# EAGLE schematic Sen (EAGLE 6.0)
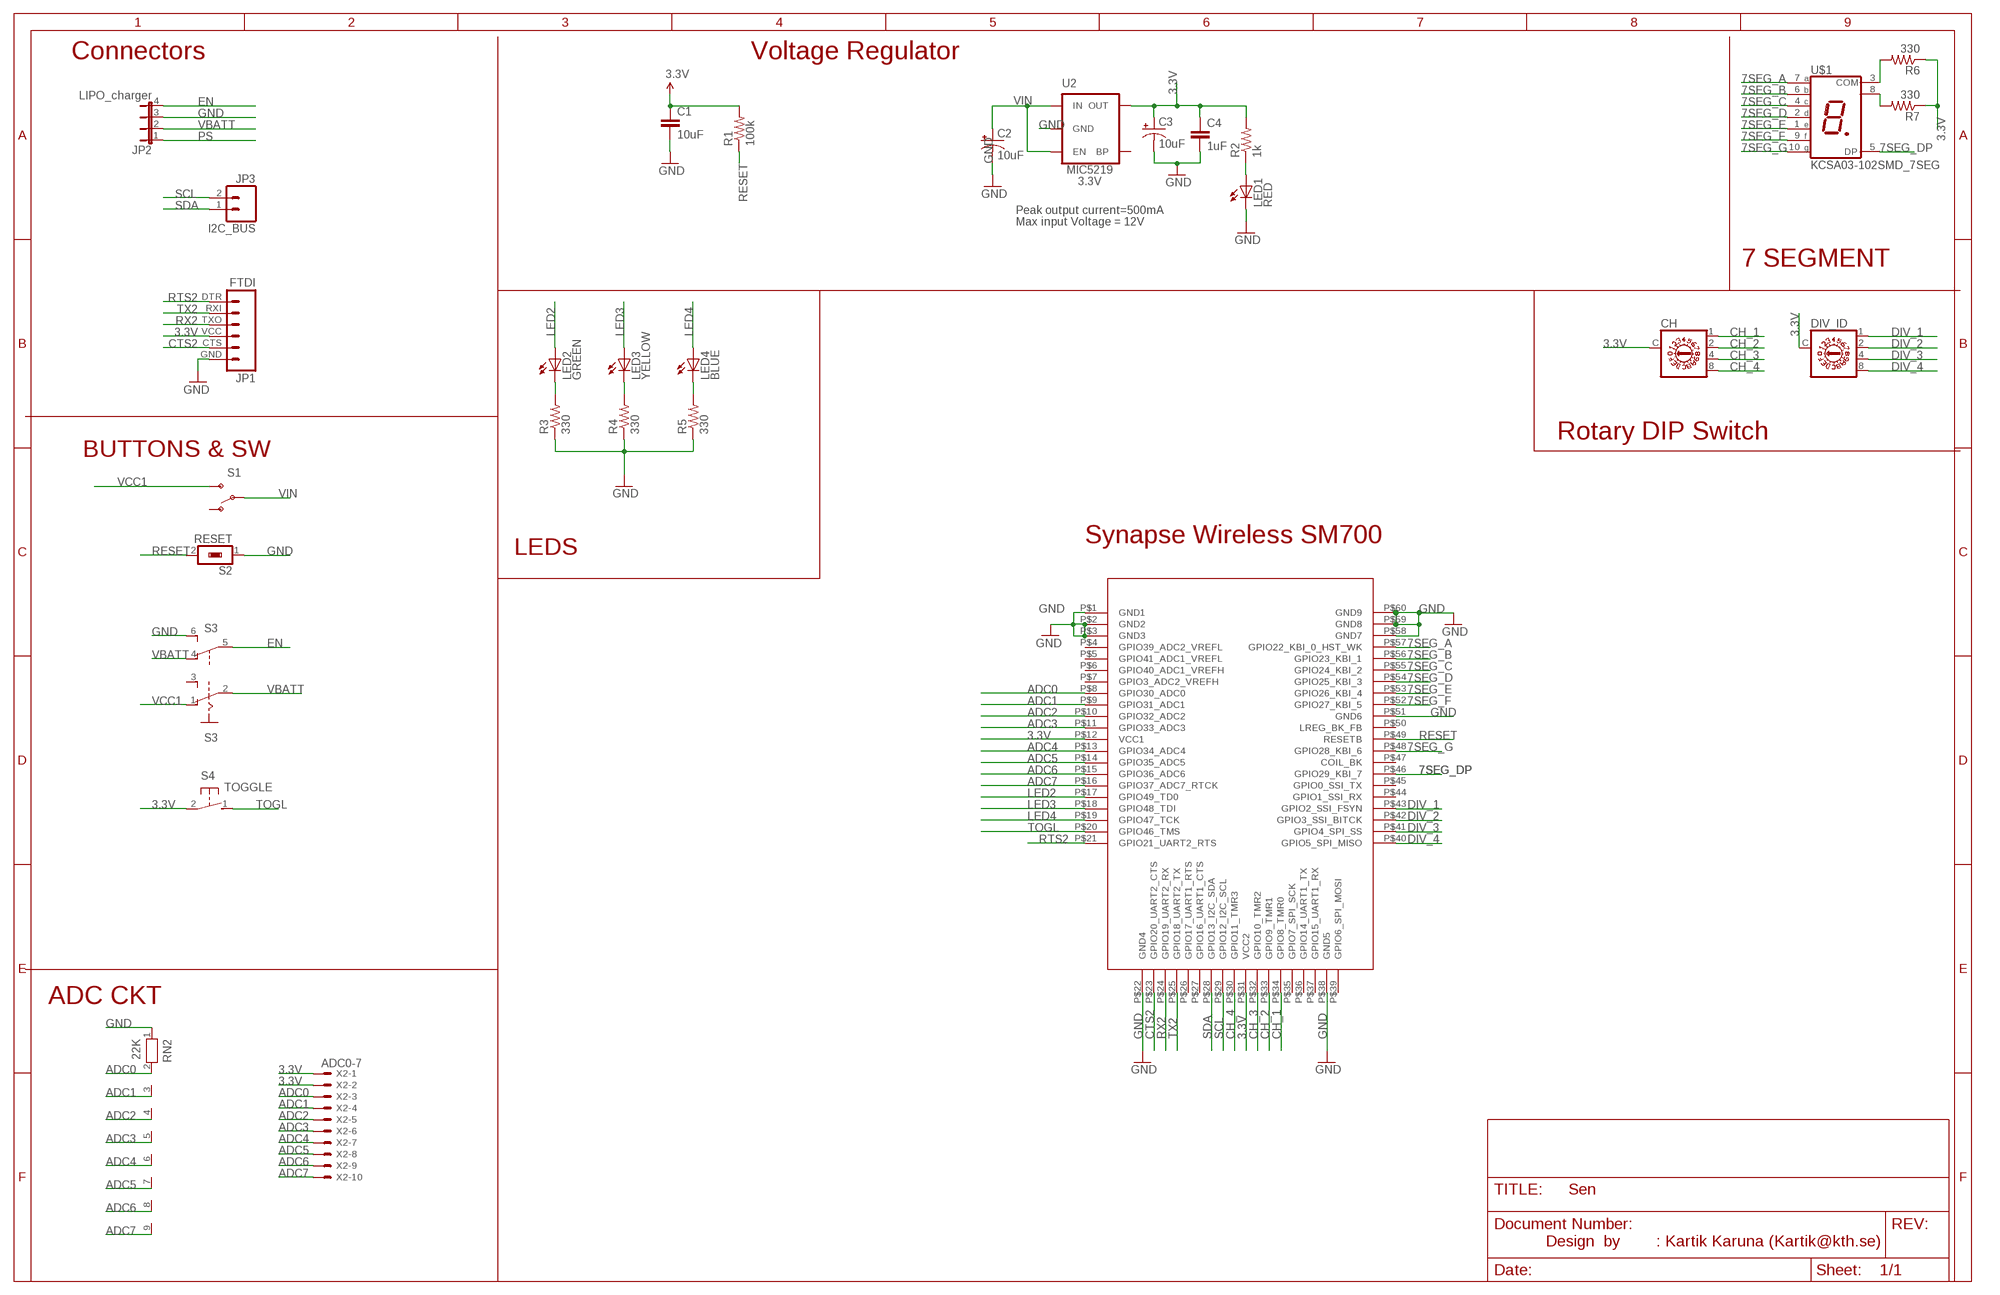
[diagram p0: schematic, sheet 1]

## Parts
C1  10uF  CAP0402-CAP  [0402-CAP]
C2  10uF  CAP_POL1206  [EIA3216]
C3  10uF  CAP_POL1206  [EIA3216]
C4  1uF  CAP0402-CAP  [0402-CAP]
CH  A1353HEX  [A1353HEX]
DIV_ID  A1353HEX  [A1353HEX]
JP1  FTDI  FTDI_BASICPTH  [FTDI_BASIC]
JP2  LIPO_charger  JP4E  [JP4]
JP3  I2C_BUS  M021X02_NO_SILK  [1X02_NO_SILK]
LED1  RED  LED0603  [LED-0603]
LED2  GREEN  LED0603  [LED-0603]
LED3  YELLOW  LED0603  [LED-0603]
LED4  BLUE  LED0603  [LED-0603]
R1  100k  RESISTOR0402-RES  [0402-RES]
R2  1k  RESISTOR0402-RES  [0402-RES]
R3  330  RESISTOR0402-RES  [0402-RES]
R4  330  RESISTOR0402-RES  [0402-RES]
R5  330  RESISTOR0402-RES  [0402-RES]
R6  330  RESISTOR0402-RES  [0402-RES]
R7  330  RESISTOR0402-RES  [0402-RES]
RN2  22K  RN08  [RN-9]
S1  SWITCH-SPDTSMD  [AYZ0202]
S2  RESET  TYCO_FSMSFSMSM  [TYCO_FSM]
S3  A68-A31  [A68-A31]
S4  TOGGLE  TYCO_FSMRACDA  [TYCO_FSMRACDA]
U1  SM700PC1SMD  [SYNAPSE_SN700PC1]
U2  MIC5219  V_REG_LDOSMD  [SOT23-5]
U$1  KCSA03-102SMD_7SEG  [SMD-7SEG]
X2  ADC0-7  53047-10  [53047-10]

## Nets
3.3V: C1.1 C3.A(+) C4.1 CH.C DIV_ID.C JP1.VCC R1.2 R2.2 R6.1 R7.1 S4.2 U1.P$12(VCC1) U1.P$31(VCC2) U2.5(OUT) X2.1 X2.2
7SEG_A: U1.P$57(GPIO22_KBI_0_HST_WK) U$1.7(A)
7SEG_B: U1.P$56(GPIO23_KBI_1) U$1.6(B)
7SEG_C: U1.P$55(GPIO24_KBI_2) U$1.4(C)
7SEG_D: U1.P$54(GPIO25_KBI_3) U$1.2(D)
7SEG_DP: U1.P$46(GPIO29_KBI_7) U$1.5(DP)
7SEG_E: U1.P$53(GPIO26_KBI_4) U$1.1(E)
7SEG_F: U1.P$52(GPIO27_KBI_5) U$1.9(F)
7SEG_G: U1.P$48(GPIO28_KBI_6) U$1.10(G)
ADC0: RN2.2 U1.P$8(GPIO30_ADC0) X2.3
ADC1: RN2.3 U1.P$9(GPIO31_ADC1) X2.4
ADC2: RN2.4 U1.P$10(GPIO32_ADC2) X2.5
ADC3: RN2.5 U1.P$11(GPIO33_ADC3) X2.6
ADC4: RN2.6 U1.P$13(GPIO34_ADC4) X2.7
ADC5: RN2.7 U1.P$14(GPIO35_ADC5) X2.8
ADC6: RN2.8 U1.P$15(GPIO36_ADC6) X2.9
ADC7: RN2.9 U1.P$16(GPIO37_ADC7_RTCK) X2.10
CH_1: CH.1 U1.P$34(GPIO8_TMR0)
CH_2: CH.2 U1.P$33(GPIO9_TMR1)
CH_3: CH.4 U1.P$32(GPIO10_TMR2)
CH_4: CH.8 U1.P$30(GPIO11_TMR3)
CTS2: JP1.CTS U1.P$23(GPIO20_UART2_CTS)
DIV_1: DIV_ID.1 U1.P$43(GPIO2_SSI_FSYN)
DIV_2: DIV_ID.2 U1.P$42(GPIO3_SSI_BITCK)
DIV_3: DIV_ID.4 U1.P$41(GPIO4_SPI_SS)
DIV_4: DIV_ID.8 U1.P$40(GPIO5_SPI_MISO)
EN: JP2.4 S3.5(B:P)
GND: C1.2 C2.C(-) C3.C(-) C4.2 JP1.GND JP2.3 LED1.C R3.1 R4.1 R5.1 RN2.1 S2.1 S3.6(B:S) U1.P$1(GND1) U1.P$2(GND2) U1.P$3(GND3) U1.P$22(GND4) U1.P$38(GND5) U1.P$51(GND6) U1.P$58(GND7) U1.P$59(GND8) U1.P$60(GND9) U2.2(GND)
LED2: LED2.A U1.P$17(GPIO49_TD0)
LED3: LED3.A U1.P$18(GPIO48_TDI)
LED4: LED4.A U1.P$19(GPIO47_TCK)
N$1: LED3.C R4.2
N$2: LED1.A R2.1
N$3: R6.2 U$1.3(COM)
N$4: LED2.C R3.2
N$5: R7.2 U$1.8(COM)
N$6: LED4.C R5.2
PS: JP2.1
RESET: R1.1 S2.2 U1.P$49(RESETB)
RTS2: JP1.DTR U1.P$21(GPIO21_UART2_RTS)
RX2: JP1.TXO U1.P$24(GPIO19_UART2_RX)
SCL: JP3.2 U1.P$29(GPIO12_I2C_SCL)
SDA: JP3.1 U1.P$28(GPIO13_I2C_SDA)
TOGL: S4.1 U1.P$20(GPIO46_TMS)
TX2: JP1.RXI U1.P$25(GPIO18_UART2_TX)
VBATT: JP2.2 S3.2(A:P) S3.4(B:O)
VCC1: S1.3(S) S3.1(A:O)
VIN: C2.A(+) S1.2(P) U2.1(IN) U2.3(EN)
Unconnected: S1.1(O) S3.3(A:S) U1.P$4(GPIO39_ADC2_VREFL) U1.P$5(GPIO41_ADC1_VREFL) U1.P$6(GPIO40_ADC1_VREFH) U1.P$7(GPIO3_ADC2_VREFH) U1.P$26(GPIO17_UART1_RTS) U1.P$27(GPIO16_UART1_CTS) U1.P$35(GPIO7_SPI_SCK) U1.P$36(GPIO14_UART1_TX) U1.P$37(GPIO15_UART1_RX) U1.P$39(GPIO6_SPI_MOSI) U1.P$44(GPIO1_SSI_RX) U1.P$45(GPIO0_SSI_TX) U1.P$47(COIL_BK) U1.P$50(LREG_BK_FB) U2.4(BP)

## Notes on the sheet
- Connectors | Voltage Regulator
- 3.3V
- Peak output current=500mA
- Max input Voltage = 12V
- 7 SEGMENT
- BUTTONS & SW | Rotary DIP Switch
- Synapse Wireless SM700
- LEDS
- ADC CKT
- Design  by        : Kartik Karuna (Kartik@kth.se)

## Library data of the parts
C1 C4 = SparkFun-Passives:CAP: Capacitor Standard 0603 ceramic capacitor, and 0.1" leaded capacitor.
C2 C3 = SparkFun-Passives:CAP_POL: Capacitor Polarized These are standard SMD and PTH capacitors. Normally 10uF, 47uF, and 100uF in electrolytic and tantalum varieties. Always verify the external diameter of the through hole cap, it varies with capacity, voltage, and manufacturer. The EIA devices should be standard.
CH DIV_ID = switch-dil:A1353HEX: DIL/CODE SWITCH; OC_FARNELL: unknown; OC_NEWARK: unknown
JP1 = SparkFun-Connectors:FTDI_BASIC: FTDI Basic header with labels
JP2 = jumper:JP4E: JUMPER
JP3 = SparkFun-Connectors:M02: Header 2 Standard 2-pin 0.1" header. Use with straight break away headers (SKU : PRT-00116), right angle break away headers (PRT-00553), swiss pins (PRT-00743), machine pins (PRT-00117), and female headers (PRT-00115). Molex polarized connector foot print use with SKU : PRT-08233 with associated crimp pins and housings.
LED1-LED4 = SparkFun-LED:LED: LEDs Standard schematic elements and footprints for 5mm, 3mm, 1206, and 0603 sized LEDs. 5mm - Spark Fun Electronics SKU : COM-00529 (and others)
R1-R7 = SparkFun-Passives:RESISTOR: Resistor Basic schematic elements and footprints for 0603, 1206, and PTH resistors.
RN2 = resistor-net:RN08: RESISTOR NETWORK; OC_FARNELL: unknown; OC_NEWARK: unknown
S1 = SparkFun-Electromechanical:SWITCH-SPDT: SPST Switch Simple slide switch. Spark Fun Electronics SKU : COM-00102
S2 = cy_fsmsm:TYCO_FSMS: FSMSM 12 VDC 50 mA, FSM-SM https://www1.elfa.se/data1/wwwroot/assets/datasheets/unAlcoswitch_FSM_dat_en.pdf
S3 = switch:A68-A31: SLIDING SWITCH Siemens, distributor Buerklin, 11G766
S4 = cy_fsmsm:TYCO_FSMRACDA: Rated voltage 12 VDC Rated current 50 mA Actuation force 100 g Design Through-Hole Switching type Momentary function Test voltage 250 V Contact material Ag Description FSMRACD https://www1.elfa.se/data1/wwwroot/assets/datasheets/unAlcoswitch_FSM_dat_en.pdf
U1 = Synapse_SM700PC1:SM700PC1: This device is an ARM7 32bit RF device made by Synapse-Wireless
U2 = SparkFun-PowerIC:V_REG_LDO: Voltage Regulator LDO Standard 150mA LDO voltage regulator in SOT-23 layout. Micrel part MIC5205. BP (by-pass) pin is used to lower output noise with 470pF cap.
U$1 = cy-7-seg:KCSA03-102: SURFACE MOUNT DISPLAY Light colour green Character height 7.62 mm Polarity C.C. Decimal point right Peak wave length 565 nm Rated on-state current (per LED) 20 mA Forward voltage 2.2 VDC Light intensity typ. 10000 mcd@ 10 mA Conducting-state voltage max. 2.5 VDC https://www1.elfa.se/data1/wwwroot/assets/datasheets/caKingbright_SMD-LED-Display-KCSC03102_E.pdf
X2 = con-molex:53?-10: CONNECTOR wire to board 1.25 mm (.049 inch) pitch header; MF: MOLEX; MPN: 53047-1010; OC_FARNELL: 9733086; OC_NEWARK: 57H4711